# EAGLE design 612_jetracer_appendbord (EAGLE 9.6.2)
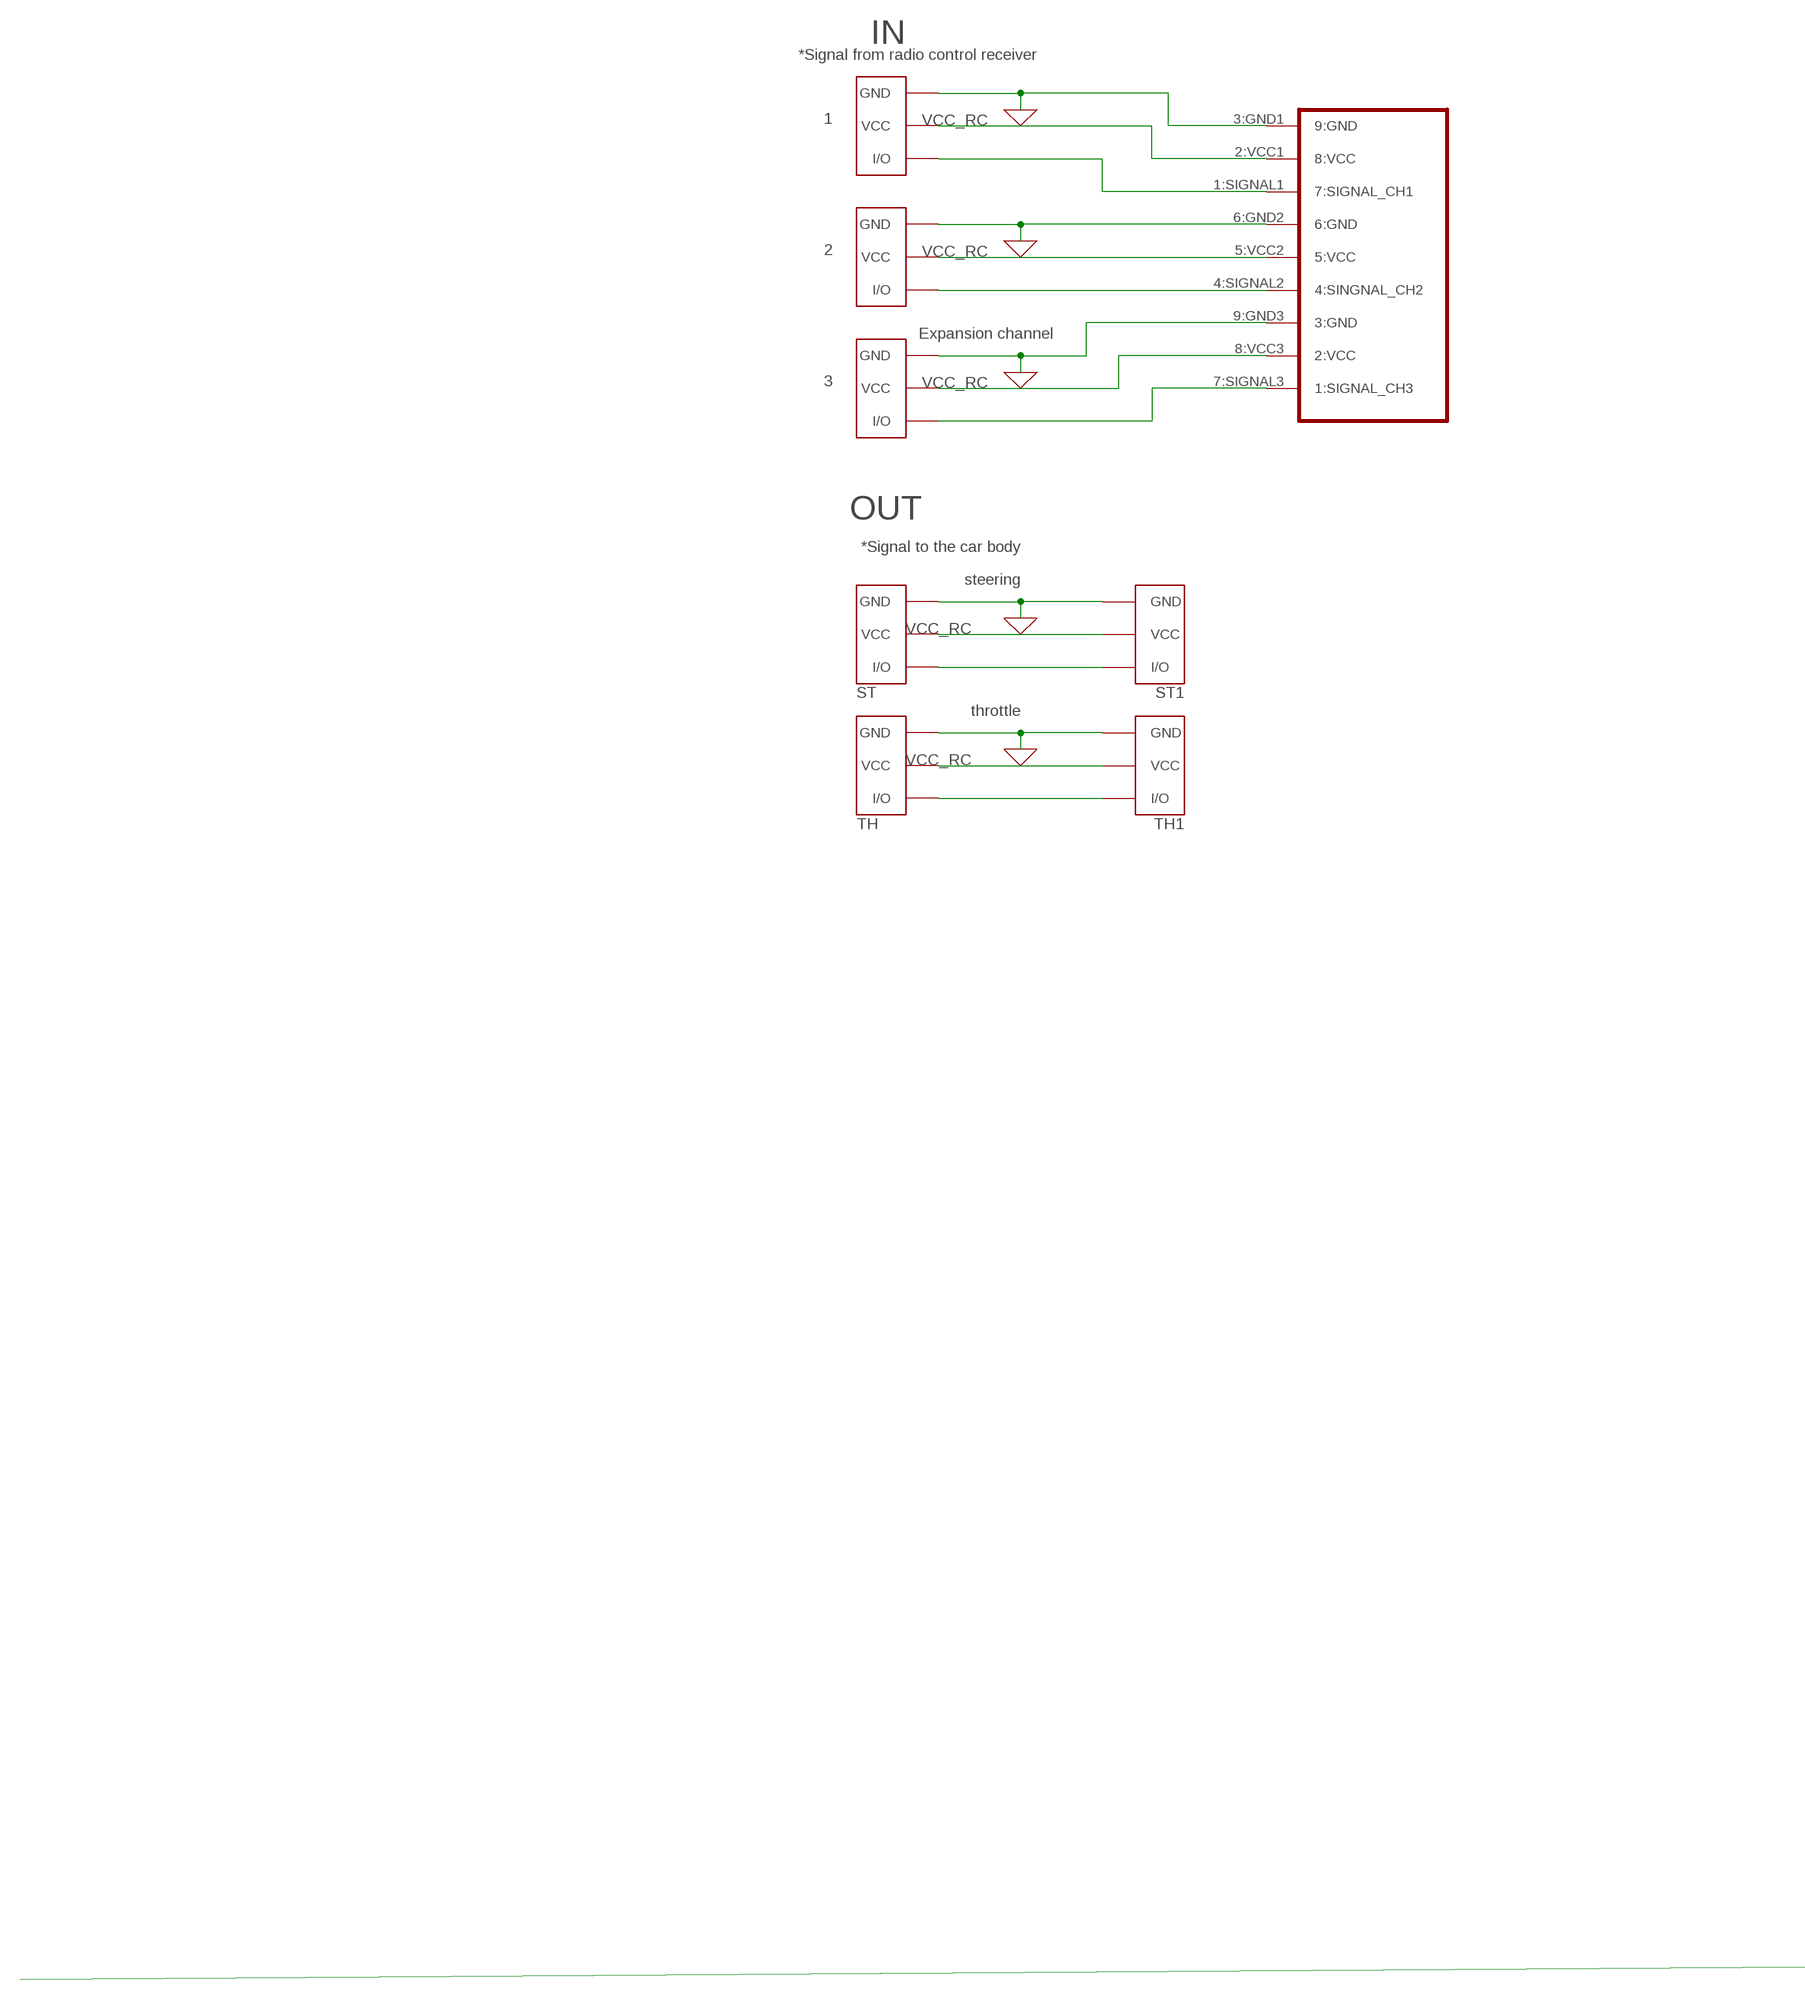
[diagram p0: schematic, sheet 1, part 1 of 2]
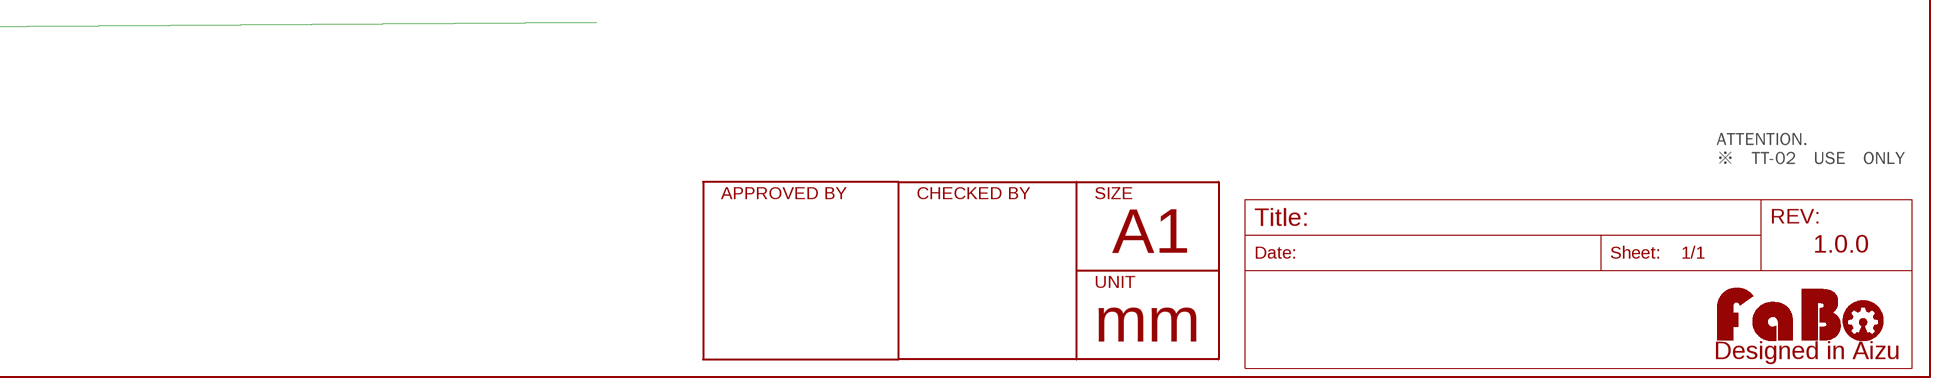
[diagram p1: schematic, sheet 1, part 2 of 2]

## Parts
1  FABO_BRICK_3PIN-HEADER  [FABO_BRICK_3PIN_HEADER]
2  FABO_BRICK_3PIN-HEADER  [FABO_BRICK_3PIN_HEADER]
3  FABO_BRICK_3PIN-HEADER  [FABO_BRICK_3PIN_HEADER]
ST  FABO_BRICK_3PIN-HEADER  [FABO_BRICK_3PIN_HEADER]
ST1  FABO_BRICK_3PIN-HEADER  [FABO_BRICK_3PIN_HEADER]
TH  FABO_BRICK_3PIN-HEADER  [FABO_BRICK_3PIN_HEADER]
TH1  FABO_BRICK_3PIN-HEADER  [FABO_BRICK_3PIN_HEADER]
U$1  RC_9PIN_OUTIN  [PNHEADER_2.54_SMT_9PIN_RC_TT01_02]
U$5  LOGO_FABO-M  [LOGO_FABO_MS]

## Nets
0: 1.GND 2.GND 3.GND ST1.GND ST.GND TH1.GND TH.GND U$1.3:GND1(9:GND) U$1.6:GND2(6:GND) U$1.9:GND3(3:GND) ; supply symbol labelled GND
N$2: ST1.I/O ST.I/O
N$3: TH1.I/O TH.I/O
N$4: 3.I/O U$1.7:SIGNAL3(1:SIGNAL_CH3)
N$5: 2.I/O U$1.4:SIGNAL2(4:SINGNAL_CH2)
N$6: 1.I/O U$1.1:SIGNAL1(7:SIGNAL_CH1)
VCC_RC: 1.VCC 2.VCC 3.VCC ST1.VCC ST.VCC TH1.VCC TH.VCC U$1.2:VCC1(8:VCC) U$1.5:VCC2(5:VCC) U$1.8:VCC3(2:VCC)

## Notes on the sheet
- IN
- *Signal from radio control receiver
- Expansion channel
- OUT
- *Signal to the car body
- steering
- throttle
- ATTENTION.
  ※　TT-02　USE　ONLY
- 1.0.0

## Library data of the parts
1-3 ST ST1 TH TH1 = FaBo-Template:FABO_BRICK_3PIN: FaBo Brick 3pin
U$1 = FaBo-PIN:RC_9PIN_OUTIN
U$5 = FaBo-Logo:LOGO_FABO

## Board
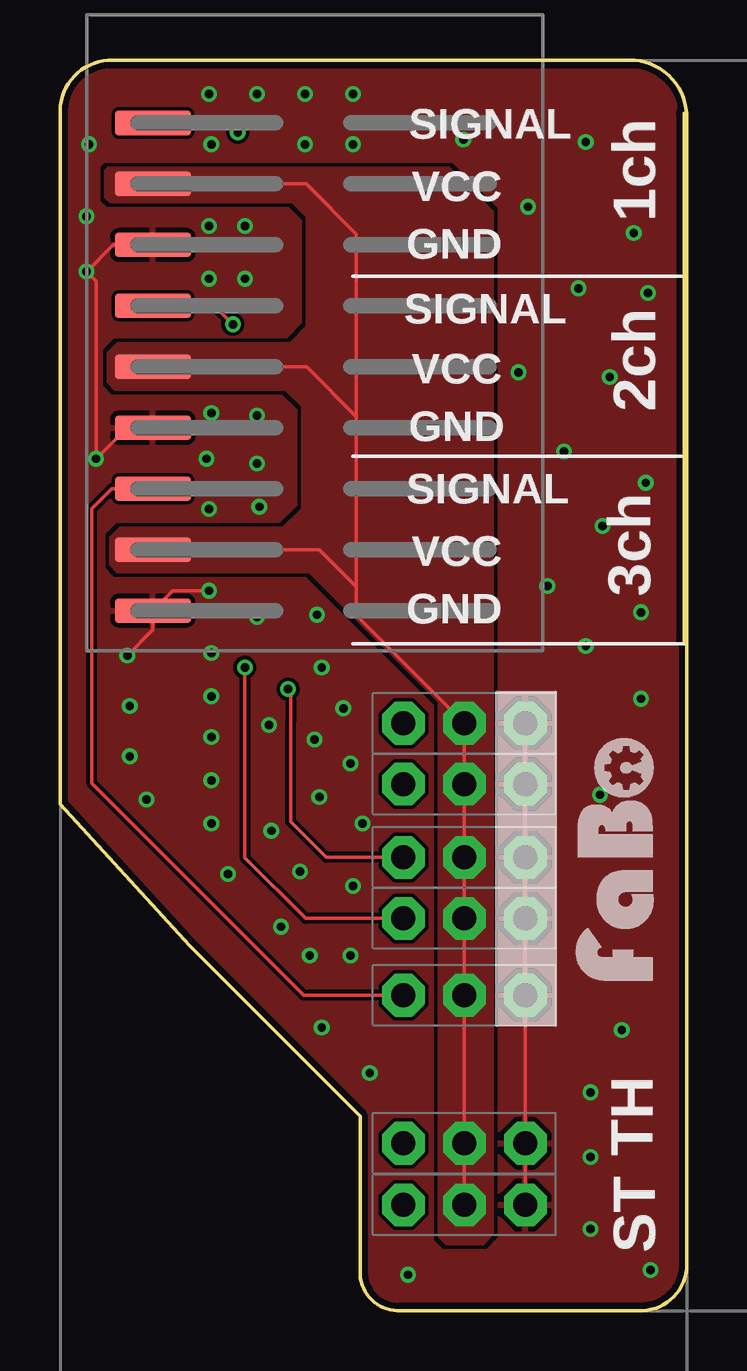
[diagram p2: board, top side]
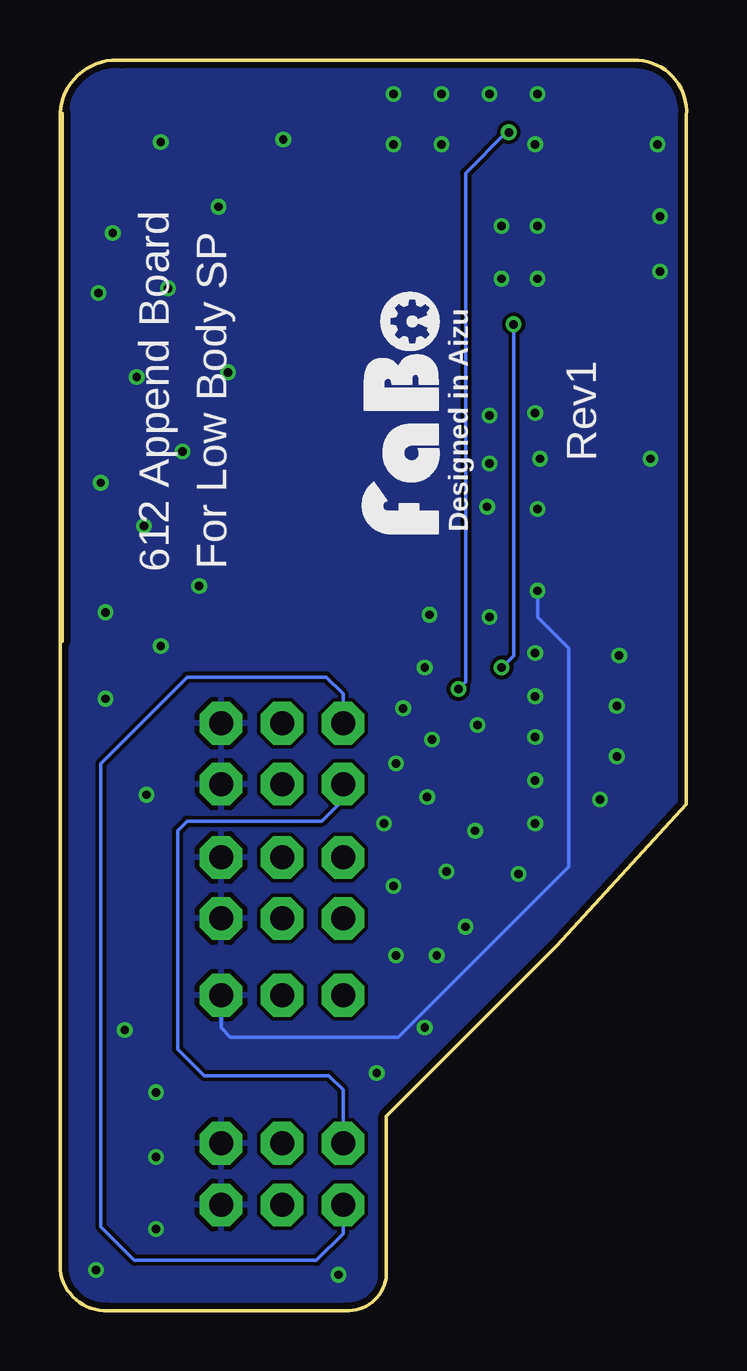
[diagram p3: board, bottom side, seen from below]

Size 26.1 x 52.12 mm. Coordinates in mm from the lower left corner, seen from the top.
Outline: 26,49.9 26,27.9
Outline: 0,21.1 0,49.8 arc-90 2,52.1 23.5,52.1 arc-92 26.1,49.9 26.1,1.7 arc-85 24.1,0 14.2,0 arc-90 12.5,1.5 12.5,8.1 5.4,15.2 0,21.1
Copper layers (1*16): Top 0.035mm / dielectric 1.6mm / Bottom 0.035mm
Design rules "PCBway": minimum track width 6mil, minimum drill 12mil, track to track 6mil, track to pad 6mil, pad to pad 6mil, via to via 6mil, smd to smd 6mil, copper to edge 10mil, drill to drill 10mil, minimum pad ring 10mil, minimum via ring 6mil, stop-mask expansion 2mil, vias tented up to drill 100mil, thermal gap 8mil

### Footprints (pad centres in the part's own frame; a part is rotated, then mirrored left to right if it is on the bottom)
FABO_BRICK_3PIN_HEADER = drill 1 pad 1.778 octagon: GND -2.54,0; I/O 2.54,0; VCC 0,0
PNHEADER_2.54_SMT_9PIN_RC_TT01_02 = smd 1.02 x 3.17: 1:SIGNAL1 -20.32,0; 2:VCC1 -17.78,0; 3:GND1 -15.24,0; 4:SIGNAL2 -12.7,0; 5:VCC2 -10.16,0; 6:GND2 -7.62,0; 7:SIGNAL3 -5.08,0; 8:VCC3 -2.54,0; 9:GND3 0,0

### Placement (x,y rotation side)
1  16.85,18.89 180 top
2  16.85,16.35 180 top
3  16.85,13.15 180 top
ST  16.85,24.48 180 top
ST1  16.85,4.41 180 top
TH  16.85,21.94 180 top
TH1  16.85,6.98 180 top
U$1  3.87,29.17 270 top
U$2  [LOGO_FABO_MS]  9.91,37.41 90 bottom
U$5  25.11,18.81 90 top

### Tracks (layer width: path | path; a pad name or v marks a point on that pad's centre or on a via)
0  (via drill 0.35)
  Top 0.152: ST.GND TH.GND 1.GND 2.GND 3.GND TH1.GND ST1.GND | v2.8,27.3 3.87,28.37 U$1.9:GND3 4.7,30 v6.2,30 | U$1.6:GND2 2.79,36.79 v1.5,35.5 1.5,42.9 v1.1,43.3 2.21,44.41 U$1.3:GND1
  Bottom 0.152: 3.GND 19.39,11.79 19,11.4 12,11.4 4.9,18.5 4.9,27.6 6.2,28.9 v6.2,30
  other vias: 1.1,45.6 1.2,48.6 7.7,45.2 7.7,43 6.2,43 6.2,45.2 10.2,50.7 10.2,48.6 12.2,48.6 12.2,50.7 12.2,17.7 10,18.3 8.8,20 8.7,24.4 6.3,27.4 6.3,25.6 12.1,14.8 10.9,11.8 12.9,9.9 7,18.2 9.2,16 6.3,22.1 12.6,20.3 10.8,21.4 12.1,22.8 10.6,23.8 6.3,23.9 21.9,27.7 20.3,30.2 22.6,32.7 21,35.8 19.1,39.1 22.9,38.9 21.6,42.6 19.5,46 23.9,44.9 16.8,48.8 21.9,48.7 22.1,9.1 23.4,11.7 22.5,21.5 22.1,6.4 22.1,3.4 8.2,37.3 8.3,33.5 6.1,35.5 24.6,1.7 8.2,35.3 8.2,28.9 6.2,33.4 6.3,37.4 6.3,48.6 6.2,50.7 8.2,50.7 10.4,14.8 14.5,1.5 24.2,25.5 24.4,34.5 24.2,29.1 24.5,42.4 2.9,25.2 2.9,23.1 3.6,21.3 6.3,20.3 11.8,25.1 10.9,26.8 10.7,29
  pour Top (rank 6): -1.1,57.2 32.8,57.2 32.8,-1.3 -1.1,-1.3
  pour Bottom (rank 6): -5.3,60.4 36.3,60.4 36.3,-0.8 -5.3,-0.8
N$2
  Bottom 0.152: ST1.I/O 14.31,3.22 15.42,2.1 23,2.1 24.4,3.5 24.4,22.8 20.8,26.4 15,26.4 14.31,25.71 ST.I/O
N$3
  Bottom 0.152: TH.I/O 14.31,21.3 15.2,20.4 20.8,20.4 21.2,20 21.2,10.9 20.1,9.8 14.9,9.8 14.31,9.21 TH1.I/O
N$4
  Top 0.152: 3.I/O 10.15,13.15 1.32,21.98 1.32,33.42 2.16,34.25 U$1.7:SIGNAL3
N$5  (via drill 0.35)
  Top 0.152: 2.I/O 10.23,16.35 7.7,18.88 7.7,25.5 v7.7,26.8 | v7.2,41.1 6.43,41.87 U$1.4:SIGNAL2
  Bottom 0.152: v7.7,26.8 7.2,27.3 v7.2,41.1
N$6  (via drill 0.35)
  Top 0.152: 1.I/O 11.1,18.89 9.6,20.38 9.6,24.5 9.6,24.53 9.6,25.8 v9.5,25.9 | v7.4,49.1 7.01,49.49 U$1.1:SIGNAL1
  Bottom 0.152: v7.4,49.1 7.5,49.1 9.2,47.4 9.2,26.2 v9.5,25.9
VCC_RC
  Top 0.152: 12.35,30.16 12.35,28.98 ST.VCC TH.VCC 1.VCC 2.VCC 3.VCC TH1.VCC ST1.VCC | U$1.8:VCC3 10.79,31.71 12.35,30.16 | U$1.5:VCC2 10.27,39.33 12.35,37.26 | 12.35,37.26 12.35,30.16 | U$1.2:VCC1 10.25,46.95 12.35,44.86 12.35,37.26
  pour Top (no thermals): 1.9,46.4 1.9,47.5 2,47.6 16.2,47.6 18,45.8 18,3.2 17.6,2.8 16.1,2.8 15.8,3.1 15.8,25.4 10.4,30.8 2.4,30.8 2.1,31.1 2.1,32.2 2.5,32.6 9.3,32.6 10.1,33.4 10.1,37.7 9.4,38.4 2.3,38.4 2,38.7 2,39.9 2.4,40.3 9.6,40.3 10.3,41 10.3,45.6 9.7,46.2 2.1,46.2

### Text on the board
tPlace: SIGNAL | 1ch | VCC | GND | SIGNAL | 2ch | VCC | GND | SIGNAL | 3ch | VCC | GND | TH | ST
bPlace: Designed in Aizu | Rev1 | For Low Body SP | 612 Append Board
Document: 612_JetRacer_AppendBoard_ForLowBodyRev1.0.0 / 2022/02/24